# EAGLE design minesweeper2 (EAGLE 7.4.0)
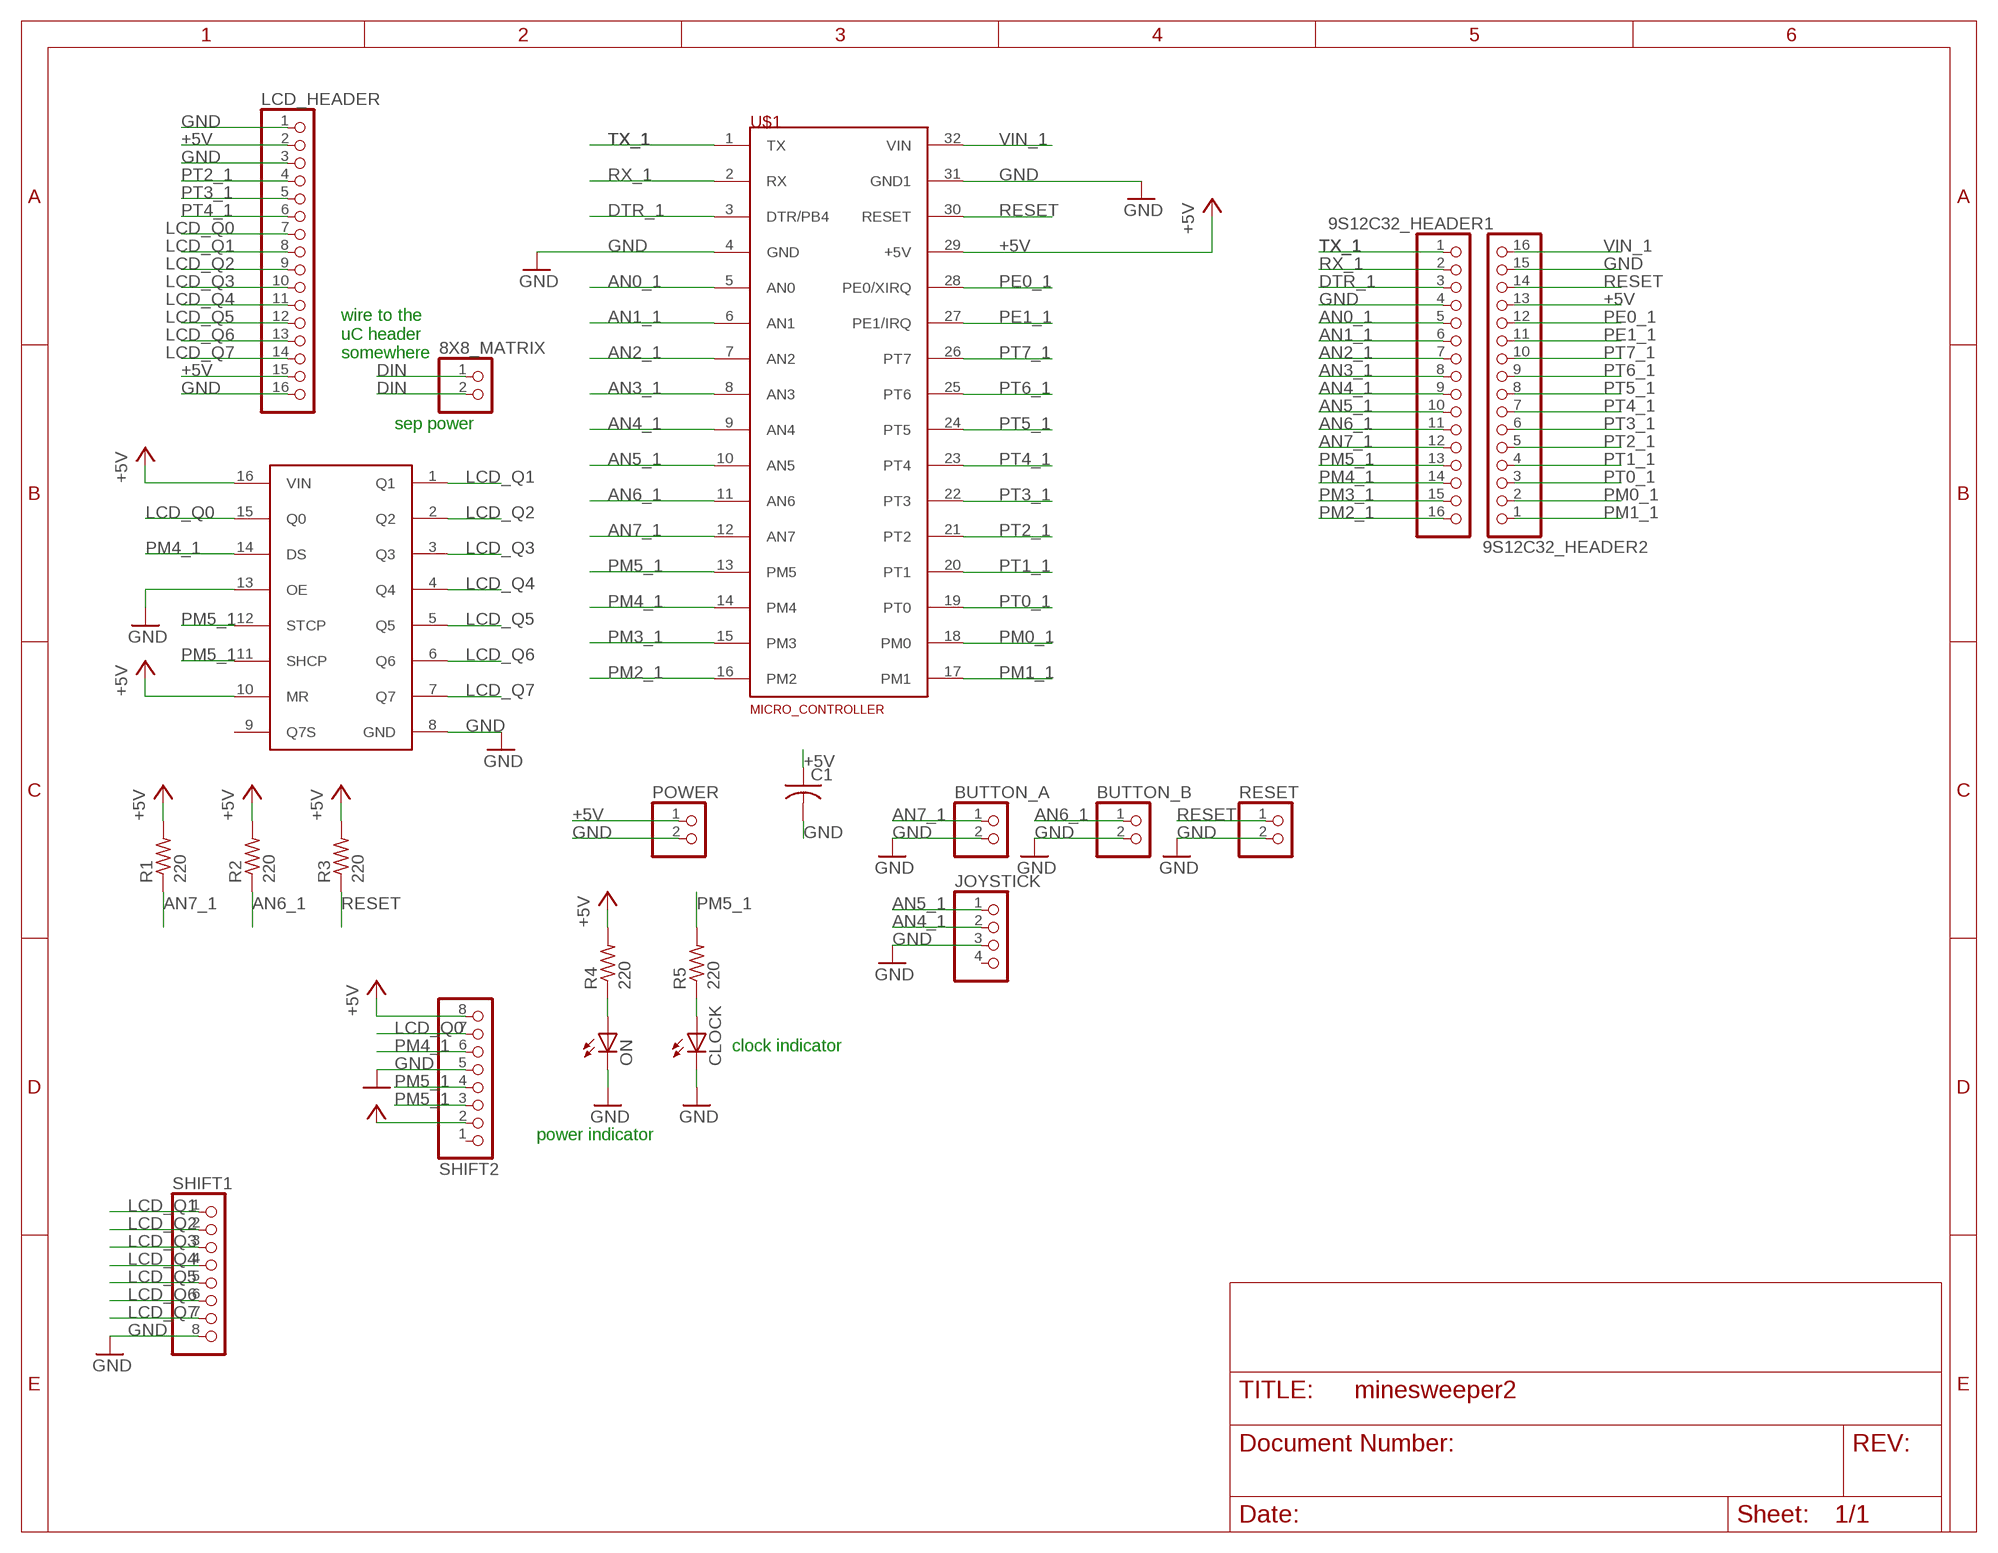
[diagram p0: schematic, sheet 1]

## Parts
8X8_MATRIX  PINHD-1X2  [1X02]
9S12C32_HEADER1  PINHD-1X16  [1X16]
9S12C32_HEADER2  PINHD-1X16  [1X16]
BUTTON_A  PINHD-1X2  [1X02]
BUTTON_B  PINHD-1X2  [1X02]
C1  C-US050-025X075  [C050-025X075]
CLOCK  LED5MM  [LED5MM]
JOYSTICK  PINHD-1X4  [1X04]
LCD_HEADER  PINHD-1X16  [1X16]
ON  LED5MM  [LED5MM]
POWER  PINHD-1X2  [1X02]
R1  220  R-US_0207/10  [0207/10]
R2  220  R-US_0207/10  [0207/10]
R3  220  R-US_0207/10  [0207/10]
R4  220  R-US_0207/10  [0207/10]
R5  220  R-US_0207/10  [0207/10]
RESET  PINHD-1X2  [1X02]
SHIFT1  PINHD-1X8  [1X08]
SHIFT2  PINHD-1X8  [1X08]
U$1  MICRO_CONTROLLER  [MICRO_CONTROLLER]
U$3  SHIFT_REGISTER  [N5]

## Nets
+5V: 9S12C32_HEADER2.13 C1.1 LCD_HEADER.2 LCD_HEADER.15 POWER.1 R1.2 R2.2 R3.2 R4.2 SHIFT2.2 SHIFT2.8 U$1.29(+5V) U$3.10(MR) U$3.16(VIN)
AN0_1: 9S12C32_HEADER1.5 U$1.5(AN0)
AN1_1: 9S12C32_HEADER1.6 U$1.6(AN1)
AN2_1: 9S12C32_HEADER1.7 U$1.7(AN2)
AN3_1: 9S12C32_HEADER1.8 U$1.8(AN3)
AN4_1: 9S12C32_HEADER1.9 JOYSTICK.2 U$1.9(AN4)
AN5_1: 9S12C32_HEADER1.10 JOYSTICK.1 U$1.10(AN5)
AN6_1: 9S12C32_HEADER1.11 BUTTON_B.1 R2.1 U$1.11(AN6)
AN7_1: 9S12C32_HEADER1.12 BUTTON_A.1 R1.1 U$1.12(AN7)
DIN: 8X8_MATRIX.1 8X8_MATRIX.2
DTR_1: 9S12C32_HEADER1.3 U$1.3(DTR/PB4)
GND: 9S12C32_HEADER1.4 9S12C32_HEADER2.15 BUTTON_A.2 BUTTON_B.2 C1.2 CLOCK.K(C) JOYSTICK.3 LCD_HEADER.1 LCD_HEADER.3 LCD_HEADER.16 ON.K(C) POWER.2 RESET.2 SHIFT1.8 SHIFT2.5 U$1.4(GND) U$1.31(GND1) U$3.8(GND) U$3.13(OE)
LCD_Q0: LCD_HEADER.7 SHIFT2.7 U$3.15(Q0)
LCD_Q1: LCD_HEADER.8 SHIFT1.1 U$3.1(Q1)
LCD_Q2: LCD_HEADER.9 SHIFT1.2 U$3.2(Q2)
LCD_Q3: LCD_HEADER.10 SHIFT1.3 U$3.3(Q3)
LCD_Q4: LCD_HEADER.11 SHIFT1.4 U$3.4(Q4)
LCD_Q5: LCD_HEADER.12 SHIFT1.5 U$3.5(Q5)
LCD_Q6: LCD_HEADER.13 SHIFT1.6 U$3.6(Q6)
LCD_Q7: LCD_HEADER.14 SHIFT1.7 U$3.7(Q7)
N$1: ON.A R4.1
N$2: CLOCK.A R5.1
PE0_1: 9S12C32_HEADER2.12 U$1.28(PE0/XIRQ)
PE1_1: 9S12C32_HEADER2.11 U$1.27(PE1/IRQ)
PM0_1: 9S12C32_HEADER2.2 U$1.18(PM0)
PM1_1: 9S12C32_HEADER2.1 U$1.17(PM1)
PM2_1: 9S12C32_HEADER1.16 U$1.16(PM2)
PM3_1: 9S12C32_HEADER1.15 U$1.15(PM3)
PM4_1: 9S12C32_HEADER1.14 SHIFT2.6 U$1.14(PM4) U$3.14(DS)
PM5_1: 9S12C32_HEADER1.13 R5.2 SHIFT2.3 SHIFT2.4 U$1.13(PM5) U$3.11(SHCP) U$3.12(STCP)
PT0_1: 9S12C32_HEADER2.3 U$1.19(PT0)
PT1_1: 9S12C32_HEADER2.4 U$1.20(PT1)
PT2_1: 9S12C32_HEADER2.5 LCD_HEADER.4 U$1.21(PT2)
PT3_1: 9S12C32_HEADER2.6 LCD_HEADER.5 U$1.22(PT3)
PT4_1: 9S12C32_HEADER2.7 LCD_HEADER.6 U$1.23(PT4)
PT5_1: 9S12C32_HEADER2.8 U$1.24(PT5)
PT6_1: 9S12C32_HEADER2.9 U$1.25(PT6)
PT7_1: 9S12C32_HEADER2.10 U$1.26(PT7)
RESET: 9S12C32_HEADER2.14 R3.1 RESET.1 U$1.30(RESET)
RX_1: 9S12C32_HEADER1.2 U$1.2(RX)
TX_1: 9S12C32_HEADER1.1 U$1.1(TX)
VIN_1: 9S12C32_HEADER2.16 U$1.32(VIN)
Unconnected: JOYSTICK.4 SHIFT2.1 U$3.9(Q7S)

## Notes on the sheet
- wire to the 
  uC header 
  somewhere
- sep power
- clock indicator
- power indicator

## Library data of the parts
8X8_MATRIX BUTTON_A BUTTON_B POWER RESET = pinhead:PINHD-1X2: PIN HEADER
9S12C32_HEADER1 9S12C32_HEADER2 = mini_project_parts:PINHD-1X16: PIN HEADER
C1 = rcl:C-US: CAPACITOR, American symbol
CLOCK ON = led:LED: LED OSRAM: - CHIPLED LG R971, LG N971, LY N971, LG Q971, LY Q971, LO R971, LY R971 LH N974, LH R974 LS Q976, LO Q976, LY Q976 LO Q996 - Hyper CHIPLED LW Q18S LB Q993, LB Q99A, LB R99A - SideLED LS A670, LO A670, LY A670, LG A670, LP A670 LB A673, LV A673, LT A673, LW A673 LH A674 LY A675 LS A676, LA A676, LO A676, LY A676, LW A676 LS A679, LY A679, LG A679 - Hyper Micro SIDELED® LS Y876, LA Y876, LO Y876, LY Y876 LT Y87S - SmartLED LW L88C, LW L88S LB L89C, LB L89S, LG L890 LS L89K, LO L89K, LY L89K LS L896, LA L896, LO L896, LY L896 - TOPLED LS T670, LO T670, LY T670, LG T670, LP T670 LSG T670, LSP T670, LSY T670, LOP T670, LYG T670 LG T671, LOG T671, LSG T671 LB T673, LV T673, LT T673, LW T673 LH T674 LS T676, LA T676, LO T676, LY T676, LB T676, LH T676, LSB T676, LW T676 LB T67C, LV T67C, LT T67C, LS T67K, LO T67K, LY T67K, LW E67C LS E67B, LA E67B, LO E67B, LY E67B, LB E67C, LV E67C, LT E67C LW T67C LS T679, LY T679, LG T679 LS T770, LO T770, LY T770, LG T770, LP T770 LB T773, LV T773, LT T773, LW T773 LH T774 LS E675, LA E675, LY E675, LS T675 LS T776, LA T776, LO T776, LY T776, LB T776 LHGB T686 LT T68C, LB T68C - Hyper Mini TOPLED® LB M676 - Mini TOPLED Santana® LG M470 LS M47K, LO M47K, LY M47K Source: http://www.osram.convergy.de LUXEON: - LUMILED® LXK2-PW12-R00, LXK2-PW12-S00, LXK2-PW14-U00, LXK2-PW14-V00 LXK2-PM12-R00, LXK2-PM12-S00, LXK2-PM14-U00 LXK2-PE12-Q00, LXK2-PE12-R00, LXK2-PE12-S00, LXK2-PE14-T00, LXK2-PE14-U00 LXK2-PB12-K00, LXK2-PB12-L00, LXK2-PB12-M00, LXK2-PB14-N00, LXK2-PB14-P00, LXK2-PB14-Q00 LXK2-PR12-L00, LXK2-PR12-M00, LXK2-PR14-Q00, LXK2-PR14-R00 LXK2-PD12-Q00, LXK2-PD12-R00, LXK2-PD12-S00 LXK2-PH12-R00, LXK2-PH12-S00 LXK2-PL12-P00, LXK2-PL12-Q00, LXK2-PL12-R00 Source: www.luxeon.com KINGBRIGHT: KA-3528ASYC Source: www.kingbright.com
JOYSTICK = pinhead:PINHD-1X4: PIN HEADER
LCD_HEADER = pinhead:PINHD-1X16: PIN HEADER
R1-R5 = resistor:R-US_: RESISTOR, American symbol
SHIFT1 SHIFT2 = pinhead:PINHD-1X8: PIN HEADER
U$1 = mini_project_parts:MICRO_CONTROLLER
U$3 = mini_project_parts:SHIFT_REGISTER

## Board
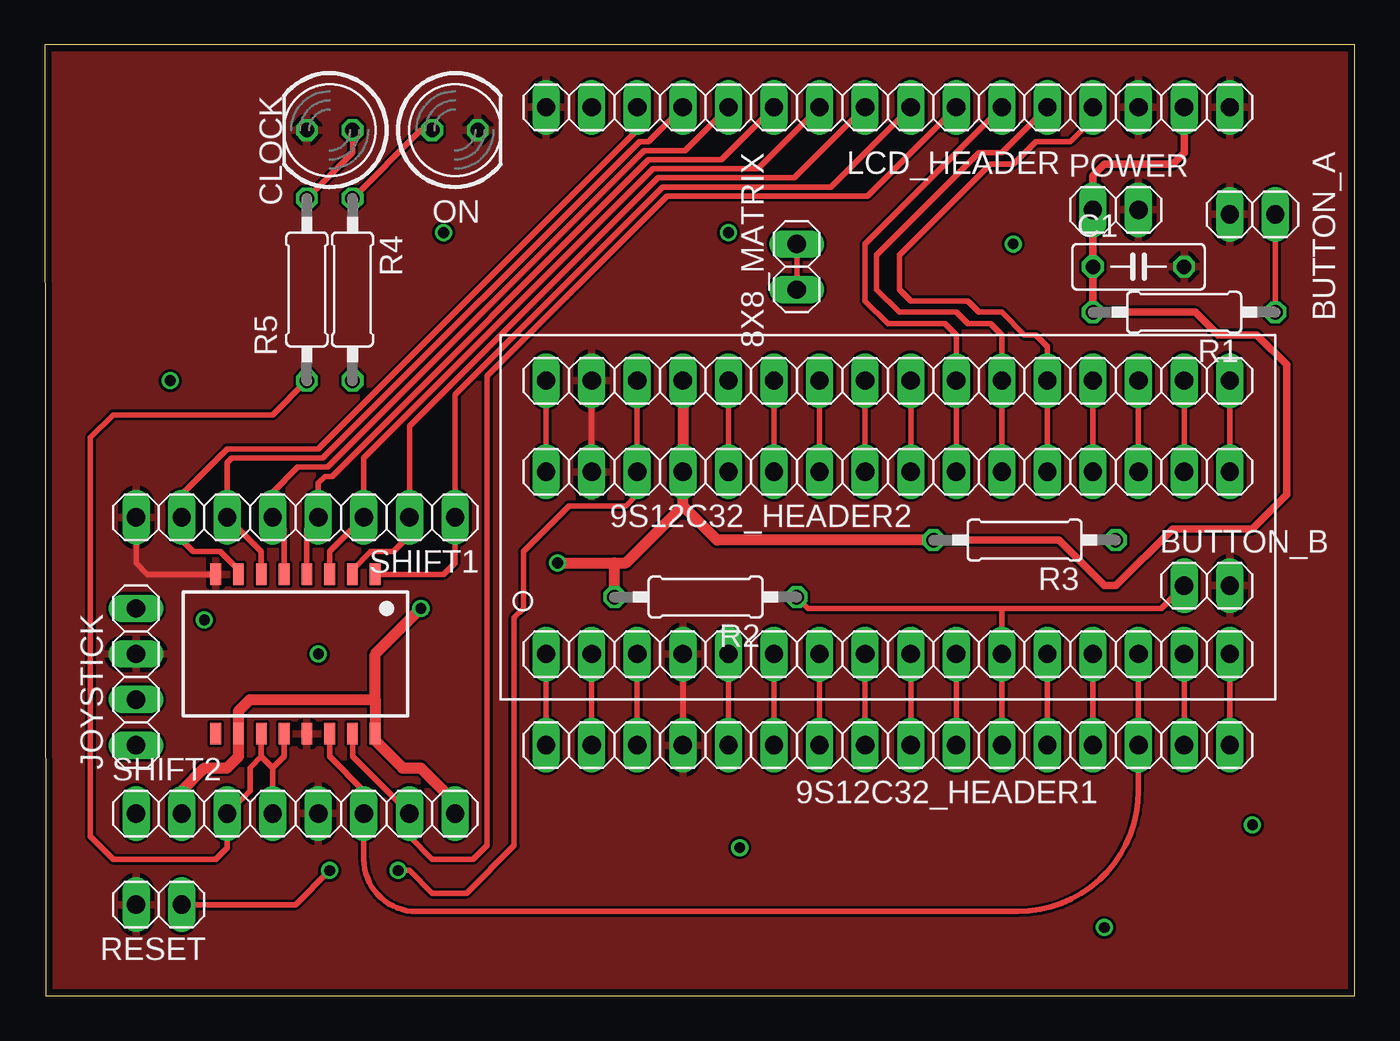
[diagram p1: board, top side]
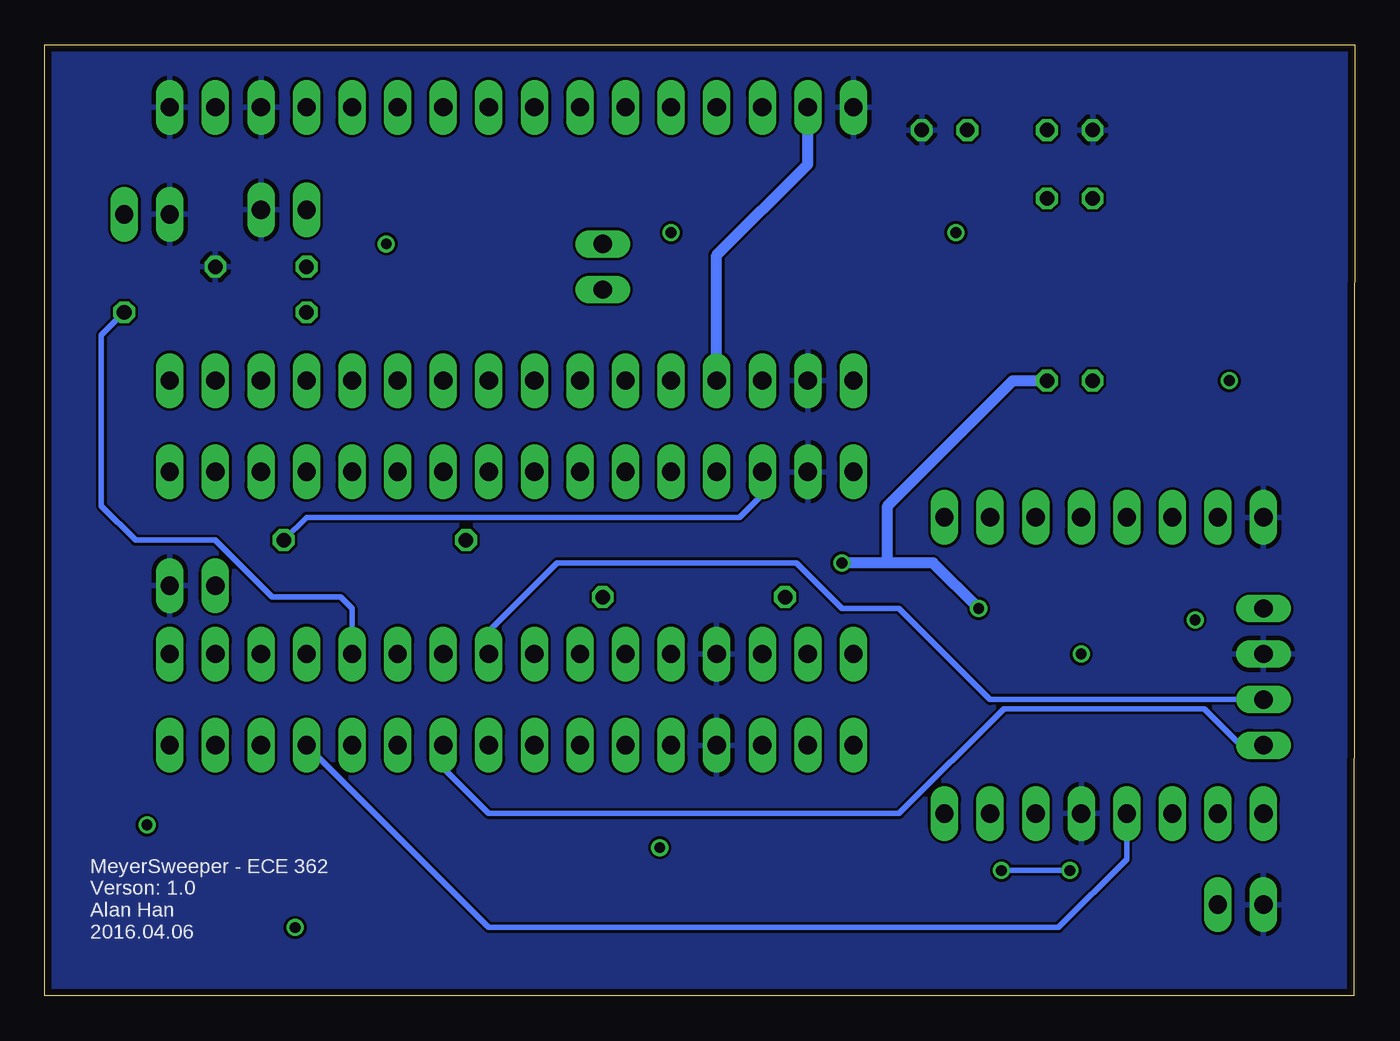
[diagram p2: board, bottom side, seen from below]

Size 73 x 53.01 mm. Coordinates in mm from the lower left corner, seen from the top.
Outline: 0.04,0.01 73,0 73,53.01 0,53.01 0.04,0.01
Copper layers (1*16): Top 0.0356mm / dielectric 1.5011mm / Bottom 0.0356mm
Design rules "LaenPCBOrder": minimum track width 6mil, minimum drill 13mil, track to track 6mil, track to pad 6mil, pad to pad 6mil, via to via 6mil, smd to smd 6mil, copper to edge 15mil, drill to drill 6mil, minimum pad ring 7mil, minimum via ring 7mil, stop-mask expansion 3mil, vias tented up to drill 0mil, thermal gap 10mil

### Footprints (pad centres in the part's own frame; a part is rotated, then mirrored left to right if it is on the bottom)
1X02 = drill 1.016 long: 1 -1.27,0; 2 1.27,0
1X16 = drill 1.016 long: 1 -19.05,0; 2 -16.51,0; 3 -13.97,0; 4 -11.43,0; 5 -8.89,0; 6 -6.35,0; 7 -3.81,0; 8 -1.27,0; 9 1.27,0; 10 3.81,0; 11 6.35,0; 12 8.89,0; 13 11.43,0; 14 13.97,0; 15 16.51,0; 16 19.05,0
C050-025X075 = drill 0.813 octagon: 1 -2.54,0; 2 2.54,0
LED5MM = drill 0.813 octagon: A -1.27,0; K 1.27,0
1X04 = drill 1.016 long: 1 -3.81,0; 2 -1.27,0; 3 1.27,0; 4 3.81,0
0207/10 = drill 0.813 octagon: 1 -5.08,0; 2 5.08,0
1X08 = drill 1.016 long: 1 -8.89,0; 2 -6.35,0; 3 -3.81,0; 4 -1.27,0; 5 1.27,0; 6 3.81,0; 7 6.35,0; 8 8.89,0
MICRO_CONTROLLER = drill 1.016 long: 1 0,0; 2 2.54,0; 3 5.08,0; 4 7.62,0; 5 10.16,0; 6 12.7,0; 7 15.24,0; 8 17.78,0; 9 20.32,0; 10 22.86,0; 11 25.4,0; 12 27.94,0; 13 30.48,0; 14 33.02,0; 15 35.56,0; 16 38.1,0; 17 38.1,15.24; 18 35.56,15.24; 19 33.02,15.24; 20 30.48,15.24; 21 27.94,15.24; 22 25.4,15.24; 23 22.86,15.24; 24 20.32,15.24; 25 17.78,15.24; 26 15.24,15.24; 27 12.7,15.24; 28 10.16,15.24; 29 7.62,15.24; 30 5.08,15.24; 31 2.54,15.24; 32 0,15.24
N5 = smd 0.6 x 1.2: 1 -4.445,-4.445; 2 -3.175,-4.445; 3 -1.905,-4.445; 4 -0.635,-4.445; 5 0.635,-4.445; 6 1.905,-4.445; 7 3.175,-4.445; 8 4.445,-4.445; 9 4.445,4.445; 10 3.175,4.445; 11 1.905,4.445; 12 0.635,4.445; 13 -0.635,4.445; 14 -1.905,4.445; 15 -3.175,4.445; 16 -4.445,4.445

### Placement (x,y rotation side)
8X8_MATRIX  41.91,40.64 270 top
9S12C32_HEADER1  46.99,13.97 0 top
9S12C32_HEADER2  46.99,29.21 180 top
BUTTON_A  67.31,43.56 180 top
BUTTON_B  64.77,22.86 0 top
C1  60.96,40.64 0 top
CLOCK  15.88,48.26 180 top
JOYSTICK  5.08,17.78 90 top
LCD_HEADER  46.99,49.53 180 top
ON  22.86,48.26 0 top
POWER  59.69,43.81 0 top
R1  63.5,38.1 180 top
R2  36.83,22.23 180 top
R3  54.61,25.4 180 top
R4  17.14,39.37 270 top
R5  14.61,39.37 270 top
RESET  6.35,5.08 180 top
SHIFT1  13.97,26.67 180 top
SHIFT2  13.97,10.16 0 top
U$1  27.94,19.05 0 top
U$3  13.97,19.05 180 top

### Tracks (layer width: path | path; a pad name or v marks a point on that pad's centre or on a via)
+5V  (via drill 0.6 pad 0.41, 0.6 pad 0.61)
  Top 0.305: 18.41,14.22 U$3.16
  Top 0.406: R3.2 56.52,25.4 59.05,22.86 59.69,22.86 62.87,26.04 67.31,26.04 69.22,27.94 69.22,35.18 67.56,36.83 65.41,36.83 64.14,38.1 R1.2 C1.1 POWER.1 58.42,45.72 59.05,46.35 62.87,46.35 63.5,46.99 LCD_HEADER.2
  Top 0.61: SHIFT2.2 7.62,11.43 8.89,12.7 10.16,12.7 10.79,13.34 U$3.10 10.79,15.88 11.43,16.51 18.41,16.51 | 18.41,16.51 U$3.16 | 18.41,14.22 19.94,12.7 20.95,12.7 22.86,10.79 SHIFT2.8 | R3.2 37.47,25.4 35.56,27.3 | 35.56,27.3 9S12C32_HEADER2.13 U$1.29 | R2.2 31.75,24.13 | 18.41,16.51 18.41,19.05 v20.95,21.59 | 31.75,24.13 32.38,24.13 35.56,27.3 | v28.57,24.13 31.75,24.13
  Bottom 0.61: v20.95,21.59 23.5,24.13 26.04,24.13 | 26.04,24.13 26.04,27.3 19.05,34.29 R4.2 | 26.04,24.13 v28.57,24.13 | U$1.29 35.56,41.27 30.48,46.35 LCD_HEADER.15
AN0_1
  Top 0.305: U$1.5 9S12C32_HEADER1.5
AN1_1
  Top 0.305: U$1.6 9S12C32_HEADER1.6
AN2_1
  Top 0.305: U$1.7 9S12C32_HEADER1.7
AN3_1
  Top 0.305: U$1.8 9S12C32_HEADER1.8
AN4_1
  Top 0.305: U$1.9 9S12C32_HEADER1.9
  Bottom 0.305: JOYSTICK.2 20.32,16.51 25.4,21.59 28.57,21.59 31.11,24.13 44.45,24.13 48.26,20.32 U$1.9
AN5_1
  Top 0.305: U$1.10 9S12C32_HEADER1.10
  Bottom 0.305: JOYSTICK.1 6.35,13.97 8.38,16 19.56,16 25.4,10.16 48.26,10.16 50.8,12.7 9S12C32_HEADER1.10
AN6_1
  Top 0.305: 9S12C32_HEADER1.11 U$1.11 53.34,21.59 | BUTTON_B.1 62.23,21.59 53.34,21.59 | R2.1 42.55,21.59 53.34,21.59
AN7_1
  Top 0.305: 9S12C32_HEADER1.12 U$1.12 | BUTTON_A.1 R1.1
  Bottom 0.305: R1.1 69.85,36.83 69.85,27.3 67.94,25.4 63.5,25.4 60.33,22.23 56.52,22.23 55.88,21.59 U$1.12
DIN
  Top 0.305: 8X8_MATRIX.1 8X8_MATRIX.2
DTR_1
  Top 0.305: U$1.3 9S12C32_HEADER1.3
GND
  Top 0.305: SHIFT1.8 5.08,24.13 5.71,23.5 U$3.8 | U$1.31 9S12C32_HEADER2.15 | U$1.4 9S12C32_HEADER1.4
  pour Bottom: 0,53.34 73.28,55.24 73.28,-1.02 0.02,0.02
  pour Top: 0.01,-0.05 73.03,0 73.03,54.61 0,53.09
LCD_Q0
  Top 0.305: U$3.15 17.14,13.34 SHIFT2.7 20.32,8.89 21.59,7.62 23.88,7.62 24.64,8.38 24.64,34.54 34.67,44.58 45.85,44.58 LCD_HEADER.7
LCD_Q1
  Top 0.305: U$3.1 22.23,23.5 22.86,24.13 SHIFT1.1 22.86,33.53 34.42,45.09 43.81,45.09 LCD_HEADER.8
LCD_Q2
  Top 0.305: U$3.2 17.14,23.75 18.16,24.77 19.43,24.77 20.32,25.65 SHIFT1.2 20.32,31.75 34.16,45.59 41.78,45.59 LCD_HEADER.9
LCD_Q3
  Top 0.305: U$3.3 15.88,24.77 SHIFT1.3 17.78,29.97 33.91,46.1 39.75,46.1 LCD_HEADER.10
LCD_Q4
  Top 0.305: U$3.4 14.61,26.04 SHIFT1.4 15.24,28.57 15.62,28.96 16,28.96 33.66,46.61 37.72,46.61 LCD_HEADER.11
LCD_Q5
  Top 0.305: U$3.5 13.34,26.04 SHIFT1.5 12.7,28.07 14.1,29.46 15.75,29.46 33.4,47.12 35.69,47.12 LCD_HEADER.12
LCD_Q6
  Top 0.305: U$3.6 12.06,24.77 SHIFT1.6 10.16,29.72 10.41,29.97 15.49,29.97 33.15,47.62 33.66,47.62 LCD_HEADER.13
LCD_Q7
  Top 0.305: U$3.7 10.79,23.75 9.78,24.77 8.26,24.77 7.62,25.4 SHIFT1.7 7.62,27.94 10.16,30.48 15.24,30.48 33.02,48.26 LCD_HEADER.14
N$1
  Top 0.305: R4.1 20.95,48.26 ON.A
N$2
  Top 0.305: R5.1 17.14,46.99 CLOCK.A
N$3  (via drill 0.6 pad 0.41)
  other vias: 15.24,19.05
N$12  (via drill 0.6 pad 0.41)
  other vias: 8.89,20.95
N$13  (via drill 0.6 pad 0.41)
  other vias: 6.99,34.29
N$14  (via drill 0.6 pad 0.41)
  other vias: 67.31,9.53
N$15  (via drill 0.6 pad 0.41)
  other vias: 38.73,8.26
N$16  (via drill 0.6 pad 0.41)
  other vias: 59.05,3.81
N$17  (via drill 0.6 pad 0.41)
  other vias: 38.1,42.55
N$18  (via drill 0.6 pad 0.41)
  other vias: 22.23,42.55
N$19  (via drill 0.6 pad 0.41)
  other vias: 53.98,41.91
PE0_1
  Top 0.305: U$1.28 9S12C32_HEADER2.12
PE1_1
  Top 0.305: U$1.27 9S12C32_HEADER2.11
PM0_1
  Top 0.305: 9S12C32_HEADER2.2 U$1.18
PM1_1
  Top 0.305: 9S12C32_HEADER2.1 U$1.17
PM2_1
  Top 0.305: 9S12C32_HEADER1.16 U$1.16
PM3_1
  Top 0.305: U$1.15 9S12C32_HEADER1.15
PM4_1
  Top 0.305: U$3.14 15.88,13.34 17.78,11.43 SHIFT2.6 17.78,7.62 arc90 20.7,4.7 54.23,4.7 arc90 60.96,11.43 9S12C32_HEADER1.14 U$1.14
PM5_1
  Top 0.305: SHIFT2.4 12.7,12.7 | 12.7,12.7 13.34,13.34 U$3.12 | 12.06,13.34 11.43,12.7 11.43,11.43 SHIFT2.3 10.16,8.26 9.53,7.62 3.81,7.62 2.54,8.89 2.54,31.11 3.81,32.38 12.7,32.38 R5.2 | 12.7,12.7 12.06,13.34 | 12.06,13.34 U$3.11 | 9S12C32_HEADER1.13 U$1.13
  Bottom 0.305: 9S12C32_HEADER1.13 48.26,3.81 16.51,3.81 12.7,7.62 SHIFT2.4
PT0_1
  Top 0.305: 9S12C32_HEADER2.3 U$1.19
PT1_1
  Top 0.305: 9S12C32_HEADER2.4 U$1.20
PT2_1
  Top 0.305: 9S12C32_HEADER2.5 U$1.21 55.88,36.2 55.24,36.83 54.61,36.83 53.34,38.1 52.07,38.1 51.44,38.73 48.26,38.73 47.62,39.37 47.62,41.27 52.7,46.35 53.98,46.35 55.24,47.62 57.15,47.62 58.42,48.9 LCD_HEADER.4
PT3_1
  Top 0.305: 9S12C32_HEADER2.6 U$1.22 53.34,36.83 52.7,37.47 51.44,37.47 50.8,38.1 47.62,38.1 46.35,39.37 46.35,41.27 52.07,46.99 53.34,46.99 LCD_HEADER.5
PT4_1
  Top 0.305: 9S12C32_HEADER2.7 U$1.23 50.8,36.83 50.16,37.47 46.99,37.47 45.72,38.73 45.72,41.91 LCD_HEADER.6
PT5_1
  Top 0.305: U$1.24 9S12C32_HEADER2.8
PT6_1
  Top 0.305: U$1.25 9S12C32_HEADER2.9
PT7_1
  Top 0.305: U$1.26 9S12C32_HEADER2.10
RESET  (via drill 0.6 pad 0.41)
  Top 0.305: U$1.30 9S12C32_HEADER2.14 33.02,27.94 32.38,27.3 29.21,27.3 26.67,24.77 26.67,21.59 26.16,21.08 26.16,8.38 23.5,5.71 21.59,5.71 20.32,6.99 v19.68,6.99 | RESET.1 13.97,5.08 v15.88,6.99
  Bottom 0.305: 9S12C32_HEADER2.14 33.02,27.94 34.29,26.67 58.42,26.67 R3.1 | v15.88,6.99 v19.68,6.99
RX_1
  Top 0.305: U$1.2 9S12C32_HEADER1.2
TX_1
  Top 0.305: U$1.1 9S12C32_HEADER1.1
VIN_1
  Top 0.305: U$1.32 9S12C32_HEADER2.16

### Text on the board
bPlace: MeyerSweeper - ECE 362 / Verson: 1.0 / Alan Han / 2016.04.06